# Altium schematic sheet AdcPmod.SchDoc
size A4
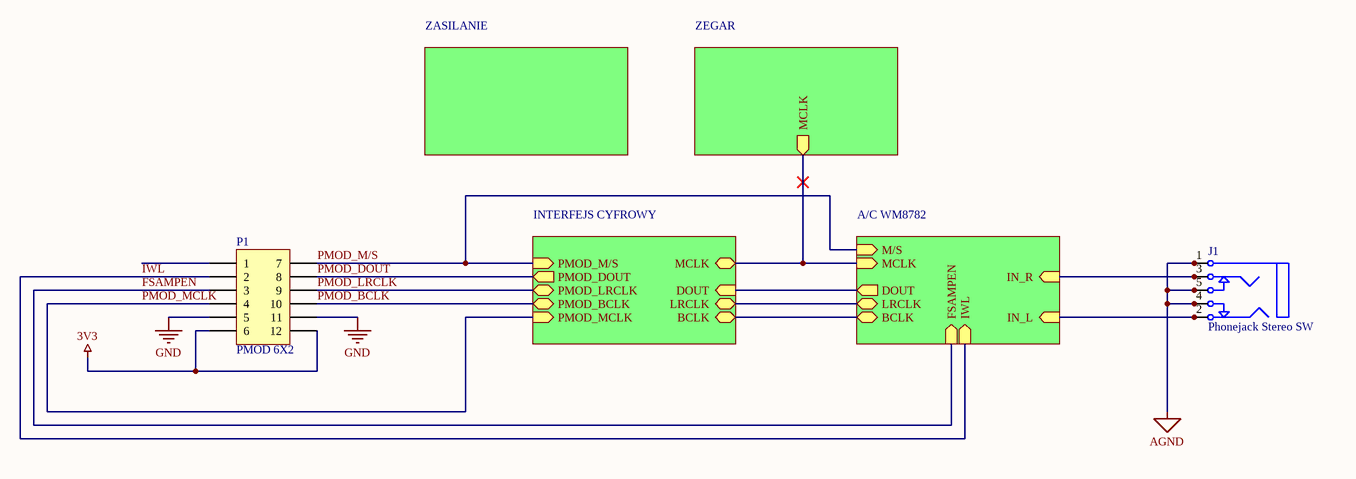
[diagram p0: AdcPmod.SchDoc]

## Parts
J1  Phonejack Stereo SW  [Phone Jack Mini Stereo SJ1 - 354X]
P1  PMOD 6X2  [HDR2X6_CEN]

## Sub-sheets
A/C WM8782 = AdcPmodWM8782.SchDoc: DOUT (out), BCLK, LRCLK (bidir), MCLK (in), IN_R (in), IN_L (in), FSAMPEN (in), IWL (in), M/S (in)
INTERFEJS CYFROWY = AdcPmodDigital.SchDoc: BCLK (bidir), LRCLK (bidir), MCLK (bidir), DOUT (in), PMOD_LRCLK (bidir), PMOD_M/S (in), PMOD_BCLK, PMOD_DOUT (out), PMOD_MCLK (in)
ZASILANIE = AdcPmodPsu.SchDoc: no entries
ZEGAR = AdcPmodClock.SchDoc: MCLK (out)

## Nets
3V3: P1.6 P1.12
AGND: J1.1 J1.1A J1.1B J1.4 J1.4A J1.4B J1.5 J1.5A J1.5B
GND: P1.5 P1.11
FSAMPEN: P1.3 ; sheet A/C WM8782/FSAMPEN
IWL: P1.2 ; sheet A/C WM8782/IWL
PMOD_BCLK: P1.10 ; sheet INTERFEJS CYFROWY/PMOD_BCLK
PMOD_DOUT: P1.8 ; sheet INTERFEJS CYFROWY/PMOD_DOUT
PMOD_LRCLK: P1.9 ; sheet INTERFEJS CYFROWY/PMOD_LRCLK
PMOD_M/S: P1.7 ; sheet INTERFEJS CYFROWY/PMOD_M/S, sheet A/C WM8782/M/S
PMOD_MCLK: P1.4 ; sheet INTERFEJS CYFROWY/PMOD_MCLK
NetJ1_2: J1.2 J1.2A J1.2B ; sheet A/C WM8782/IN_L
NetJ1_3: J1.3 J1.3A J1.3B ; sheet A/C WM8782/IN_R
(unnamed): sheet INTERFEJS CYFROWY/BCLK, sheet A/C WM8782/BCLK
(unnamed): sheet INTERFEJS CYFROWY/LRCLK, sheet A/C WM8782/LRCLK
(unnamed): sheet INTERFEJS CYFROWY/MCLK, sheet A/C WM8782/MCLK, sheet ZEGAR/MCLK
(unnamed): sheet INTERFEJS CYFROWY/DOUT, sheet A/C WM8782/DOUT

Not connected (* = marked no-connect by the designer): P1 1

## Library data of the parts
J1 = Phonejack Stereo SW: 3-Conductor Jack with 2 break contacts (normals) and 2 auxiliary make contacts; pin to pad: 1A>1 1B>1 2A>2 2B>2 3A>3 3B>3 4A>4 4B>4 5A>5 5B>5; Manufacturer: CUI; Mfr. Part No.: SJ1-3545N; Suplier Part No.: 490-SJ1-3545N; Supplier: Mouser
P1 = Header 6X2A: Header, 6-Pin, Dual row; Manufacturer: Wurth Electronics; Mfr. Part No.: 61301221021; Suplier Part No.: 710-61301221021; Supplier: Mouser